# Altium schematic sheet sensor.SchDoc: A 24-bit AD7714YRZ Analog-to-Digital Converter
size A4
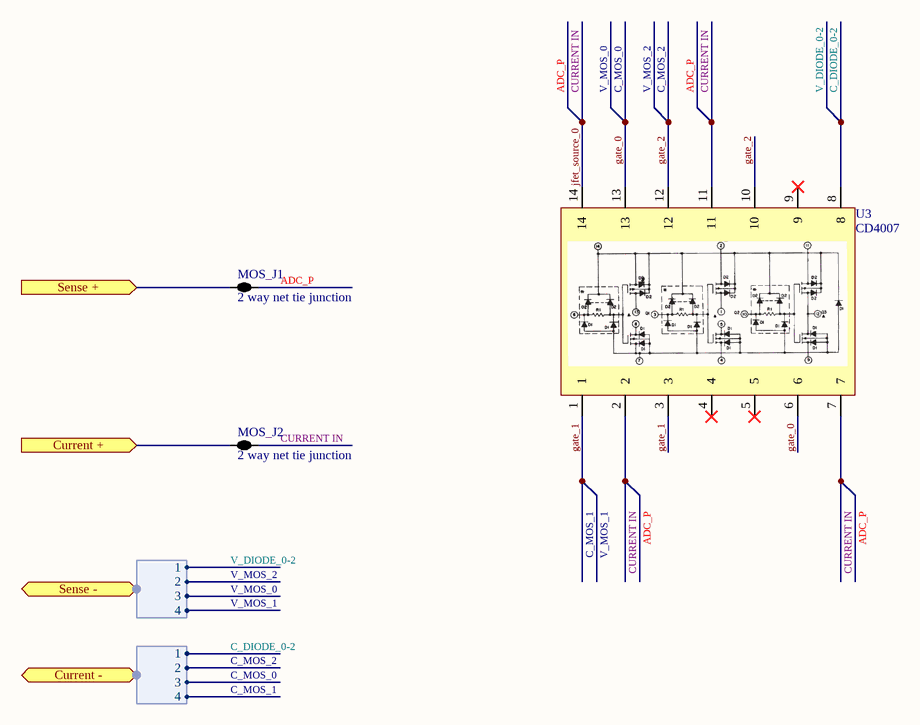
[diagram p0: sensor.SchDoc]

## Parts
MOS_J1  2 way net tie junction  [2way_LP]  (net tie, no BOM)
MOS_J2  2 way net tie junction  [2way_LP]  (net tie, no BOM)
U3  CD4007  [TSSOP14]

## Ports
Current + (in), Current - (harness ADG709_MUX_CH), Sense + (in), Sense - (harness ADG709_MUX_CH)

## Harnesses
ADG709_MUX_CH: 1, 2, 3, 4

## Nets
ADC_P: MOS_J1.2 MOS_J2.2 U3.2 U3.7 U3.11 U3.14  [also labelled CURRENT IN, jfet_source_0]
C_DIODE_0-2: U3.8 ; port Sense -.1, port Current -.1  [also labelled V_DIODE_0-2]
C_MOS_0: U3.6 U3.13 ; port Sense -.3, port Current -.3  [also labelled gate_0, V_MOS_0]
C_MOS_1: U3.1 U3.3 ; port Sense -.4, port Current -.4  [also labelled gate_1, V_MOS_1]
C_MOS_2: U3.10 U3.12 ; port Sense -.2, port Current -.2  [also labelled gate_2, V_MOS_2]
Current +: MOS_J2.1 ; port Current +
Sense +: MOS_J1.1 ; port Sense +

Not connected (* = marked no-connect by the designer): U3 4* 5* 9*

## Notes on the sheet
- Title:
- Sheet:
- of
- Author:
- Model:
- Document Number:
- Checked by:
- Iss-Rev:
- Approved by:
- Date:
- File name:

## Library data of the parts
MOS_J1 MOS_J2 = 2way: ComponentLink1URL: http://www.edatools.cz/addons; ComponentLink1Description: Source; FootprintNote: LP=12mil, MP=40mil, HP=120mil
U3 = CD4007: CMOS Dual Complementary Pair Plus Inverter; ComponentLink1URL: http://www.mouser.com/catalog/specsheets/AT45DB041D.pdf; ComponentLink1Description: Datasheet